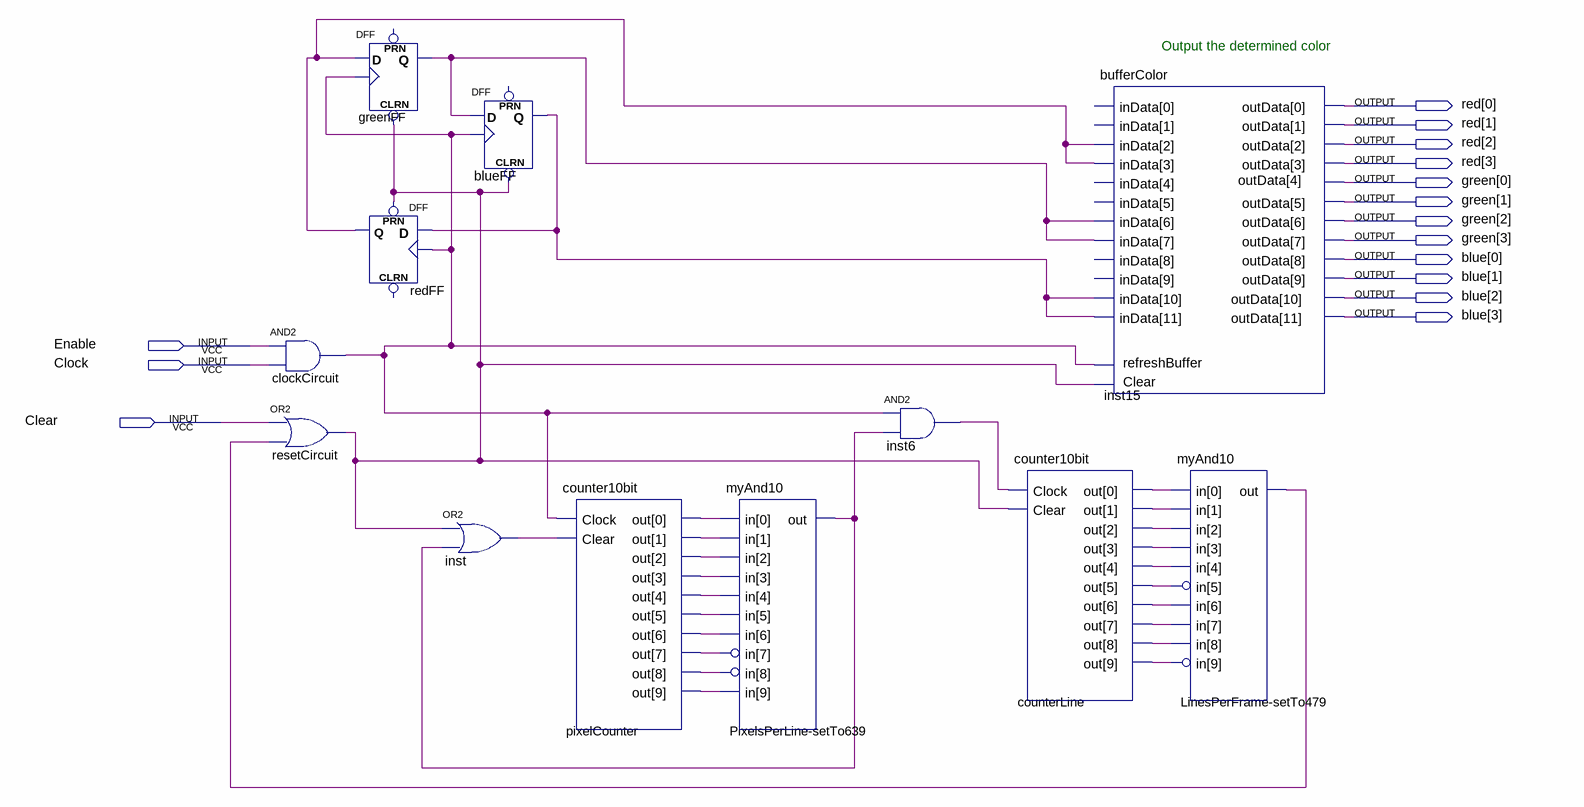
[diagram p0: schematic sheet]
// Quartus schematic colorController.bdf as structural Verilog: 12 symbols, 15 pins
module colorController (
  input  Enable,
  input  Clock,
  input  Clear,
  output [3:0] red,
  output [3:0] green,
  output [3:0] blue
);

  wire blueFF_q, clockCircuit_out, counterLine_out, counterLine_out_2, counterLine_out_3, counterLine_out_4,
       counterLine_out_5, counterLine_out_6, counterLine_out_7, counterLine_out_8, counterLine_out_9,
       counterLine_out_10, greenFF_q, inst6_out, inst_out, LinesPerFrame_setTo479_out, pixelCounter_out,
       pixelCounter_out_2, pixelCounter_out_3, pixelCounter_out_4, pixelCounter_out_5, pixelCounter_out_6,
       pixelCounter_out_7, pixelCounter_out_8, pixelCounter_out_9, pixelCounter_out_10,
       PixelsPerLine_setTo639_out, redFF_q, resetCircuit_out;

  and clockCircuit (clockCircuit_out, Enable, Clock);
  or resetCircuit (resetCircuit_out, Clear, LinesPerFrame_setTo479_out);
  DFF greenFF (.CLRN(resetCircuit_out), .CLK(clockCircuit_out), .D(redFF_q), .Q(greenFF_q));  // open: PRN
  DFF redFF (.CLK(clockCircuit_out), .D(blueFF_q), .PRN(resetCircuit_out), .Q(redFF_q));  // open: CLRN
  DFF blueFF (.CLRN(resetCircuit_out), .CLK(clockCircuit_out), .D(greenFF_q), .Q(blueFF_q));  // open: PRN
  or inst (inst_out, resetCircuit_out, PixelsPerLine_setTo639_out);
  counter10bit pixelCounter (
    .Clock(clockCircuit_out), .Clear(inst_out),
    .out({pixelCounter_out_10, pixelCounter_out_9, pixelCounter_out_8, pixelCounter_out_7, pixelCounter_out_6, pixelCounter_out_5, pixelCounter_out_4, pixelCounter_out_3, pixelCounter_out_2, pixelCounter_out}));
  myAnd10 \PixelsPerLine-setTo639  (
    .in({pixelCounter_out_10, pixelCounter_out_9, pixelCounter_out_8, pixelCounter_out_7, pixelCounter_out_6, pixelCounter_out_5, pixelCounter_out_4, pixelCounter_out_3, pixelCounter_out_2, pixelCounter_out}),
    .out(PixelsPerLine_setTo639_out));
  and inst6 (inst6_out, clockCircuit_out, PixelsPerLine_setTo639_out);
  counter10bit counterLine (
    .Clock(inst6_out), .Clear(resetCircuit_out),
    .out({counterLine_out_10, counterLine_out_9, counterLine_out_8, counterLine_out_7, counterLine_out_6, counterLine_out_5, counterLine_out_4, counterLine_out_3, counterLine_out_2, counterLine_out}));
  bufferColor inst15 (
    .inData({{2{blueFF_q}}, 2'bzz, {2{greenFF_q}}, 2'bzz, {2{redFF_q}}, 2'bzz}),
    .refreshBuffer(clockCircuit_out), .Clear(resetCircuit_out), .outData({blue, green, red}));
  myAnd10 \LinesPerFrame-setTo479  (
    .in({counterLine_out_10, counterLine_out_9, counterLine_out_8, counterLine_out_7, counterLine_out_6, counterLine_out_5, counterLine_out_4, counterLine_out_3, counterLine_out_2, counterLine_out}),
    .out(LinesPerFrame_setTo479_out));

  // Notes on the sheet:
  //   Output the determined color
endmodule
